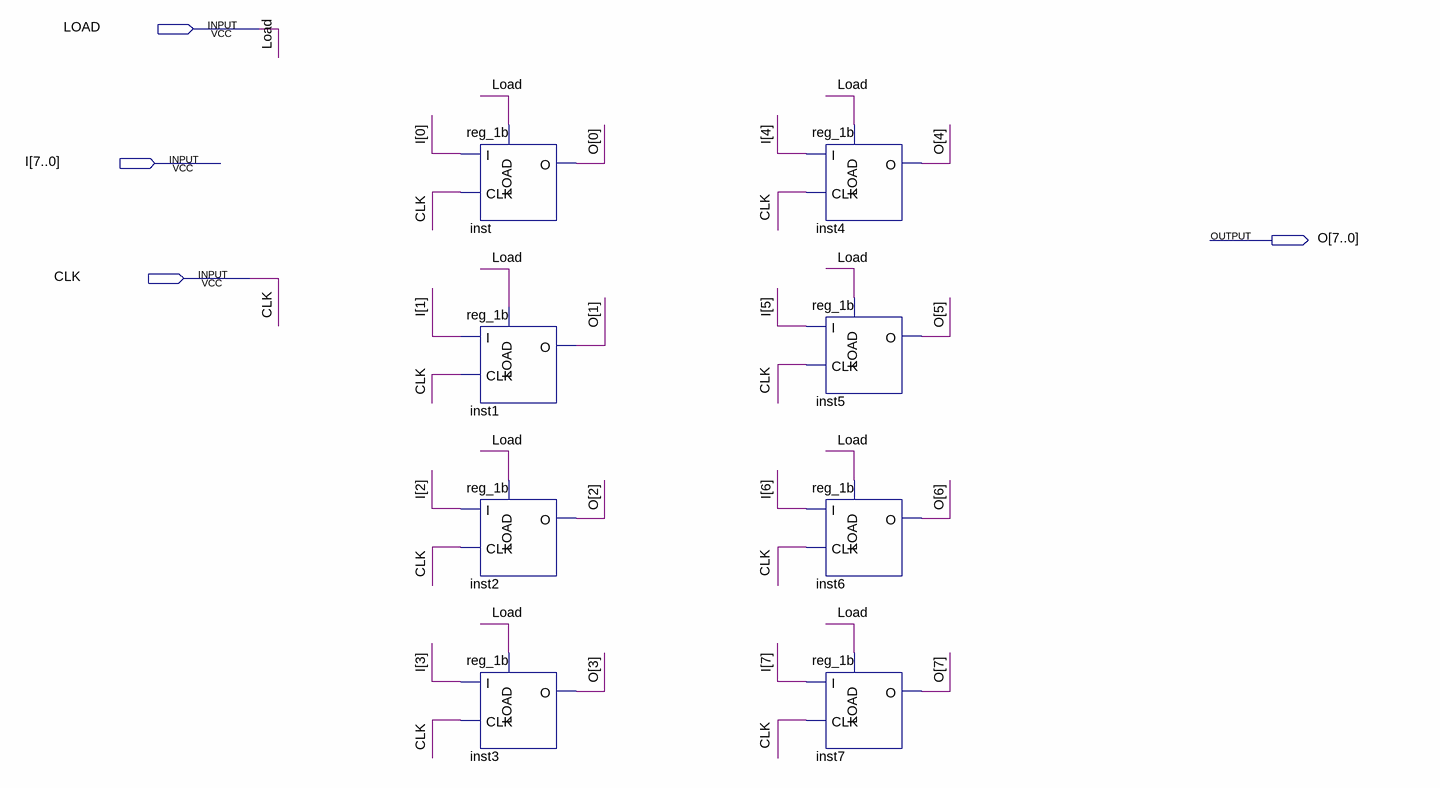
[diagram p0: schematic sheet]
// Quartus schematic reg_8b.bdf as structural Verilog: 8 symbols, 4 pins
module reg_8b (
  input  LOAD,
  input  [7:0] I,
  input  CLK,
  output [7:0] O
);

  reg_1b inst (.I(I[0]), .CLK(CLK), .LOAD(LOAD), .O(O[0]));
  reg_1b inst1 (.I(I[1]), .CLK(CLK), .LOAD(LOAD), .O(O[1]));
  reg_1b inst2 (.I(I[2]), .CLK(CLK), .LOAD(LOAD), .O(O[2]));
  reg_1b inst3 (.I(I[3]), .CLK(CLK), .LOAD(LOAD), .O(O[3]));
  reg_1b inst4 (.I(I[4]), .CLK(CLK), .LOAD(LOAD), .O(O[4]));
  reg_1b inst5 (.I(I[5]), .CLK(CLK), .LOAD(LOAD), .O(O[5]));
  reg_1b inst6 (.I(I[6]), .CLK(CLK), .LOAD(LOAD), .O(O[6]));
  reg_1b inst7 (.I(I[7]), .CLK(CLK), .LOAD(LOAD), .O(O[7]));
endmodule
